# Altium schematic sheet Gain_RF_Sch.SchDoc
size A3; Organization0: INDÚSTRIA DE MATERIAL BÉLICO DO BRASIL; Organization2: FÁBRICA DE MATERIAL DE; Organization3: COMUNICAÇÕES E ELETRÔNICA; Organization1: VINCULADA AO EXÉRCITO BRASILEIRO; Esquematico: Esquemático
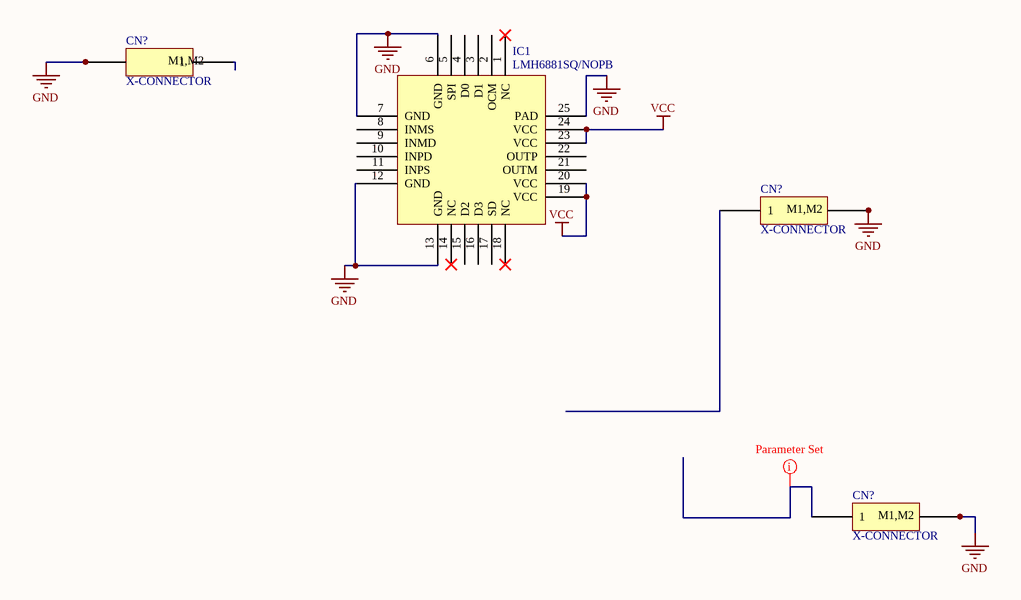
[diagram p0: Gain_RF_Sch.SchDoc]

## Parts
(Parts that share a designator on the sheet are numbered #1, #2 ... from top to bottom, then left to right.)
CN?#1  X-CONNECTOR  [X-CONNECTOR-PCB]
CN?#2  X-CONNECTOR  [X-CONNECTOR-PCB]
CN?#3  X-CONNECTOR  [X-CONNECTOR-PCB]
IC1  LMH6881SQ/NOPB  [QFN50P400X400X80_HS-25N]

## Nets
GND: CN?#1.M1 CN?#1.M2 CN?#2.M1 CN?#2.M2 CN?#3.M1 CN?#3.M2 IC1.6(GND) IC1.7(GND) IC1.12(GND) IC1.13(GND) IC1.25(PAD)
VCC: IC1.19(VCC) IC1.20(VCC) IC1.23(VCC) IC1.24(VCC)

Not connected (* = marked no-connect by the designer): CN?#1 1; CN?#2 1; CN?#3 1; IC1 1(NC)* 2(OCM) 3(D1) 4(D0) 5(SPI) 8(INMS) 9(INMD) 10(INPD) 11(INPS) 14(NC)* 15(D2) 16(D3) 17(SD) 18(NC)* 21(OUTM) 22(OUTP)

## Layout directives
net class 50ohm: NetCN?#3_1

## Notes on the sheet
- USADO EQUIP.:
- DATA:
- ENG:
- VERIF:
- HORA:
- REV:
- APROV:
- TÍTULO:
- FOLHA:
- /
- FORMATO:
- A3
- CÓDIGO:
- ESTOQUE:
- (in symbol X-CONNECTOR-5) M1,M2

## Library data of the parts
CN?#1-CN?#3 = X-CONNECTOR-5: CONECTOR PARA MÓDULOS X MICROWAVE; RoHS: Yes; Mount: TH
IC1 = LMH6881-01.A.2: IC AMP 2.4GHZ PROGR DIFF 24WQFN; Min Supply Voltage: 4.75V; Number of Circuits: 1; Max Supply Voltage: 5.25V; Operating Supply Current: 100mA; Radiation Hardening: No; -3db Bandwidth: 2.4GHz; Packaging: Tape and Reel; Min Operating Temperature: -40°C; Package Quantity: 1000; Number of Pins: 24; Lead Free: Lead Free; Max Operating Temperature: 85°C; Number of Channels: 1; Mount: Surface Mount